# Altium project Masterboard_Lora_USB.PrjPcb
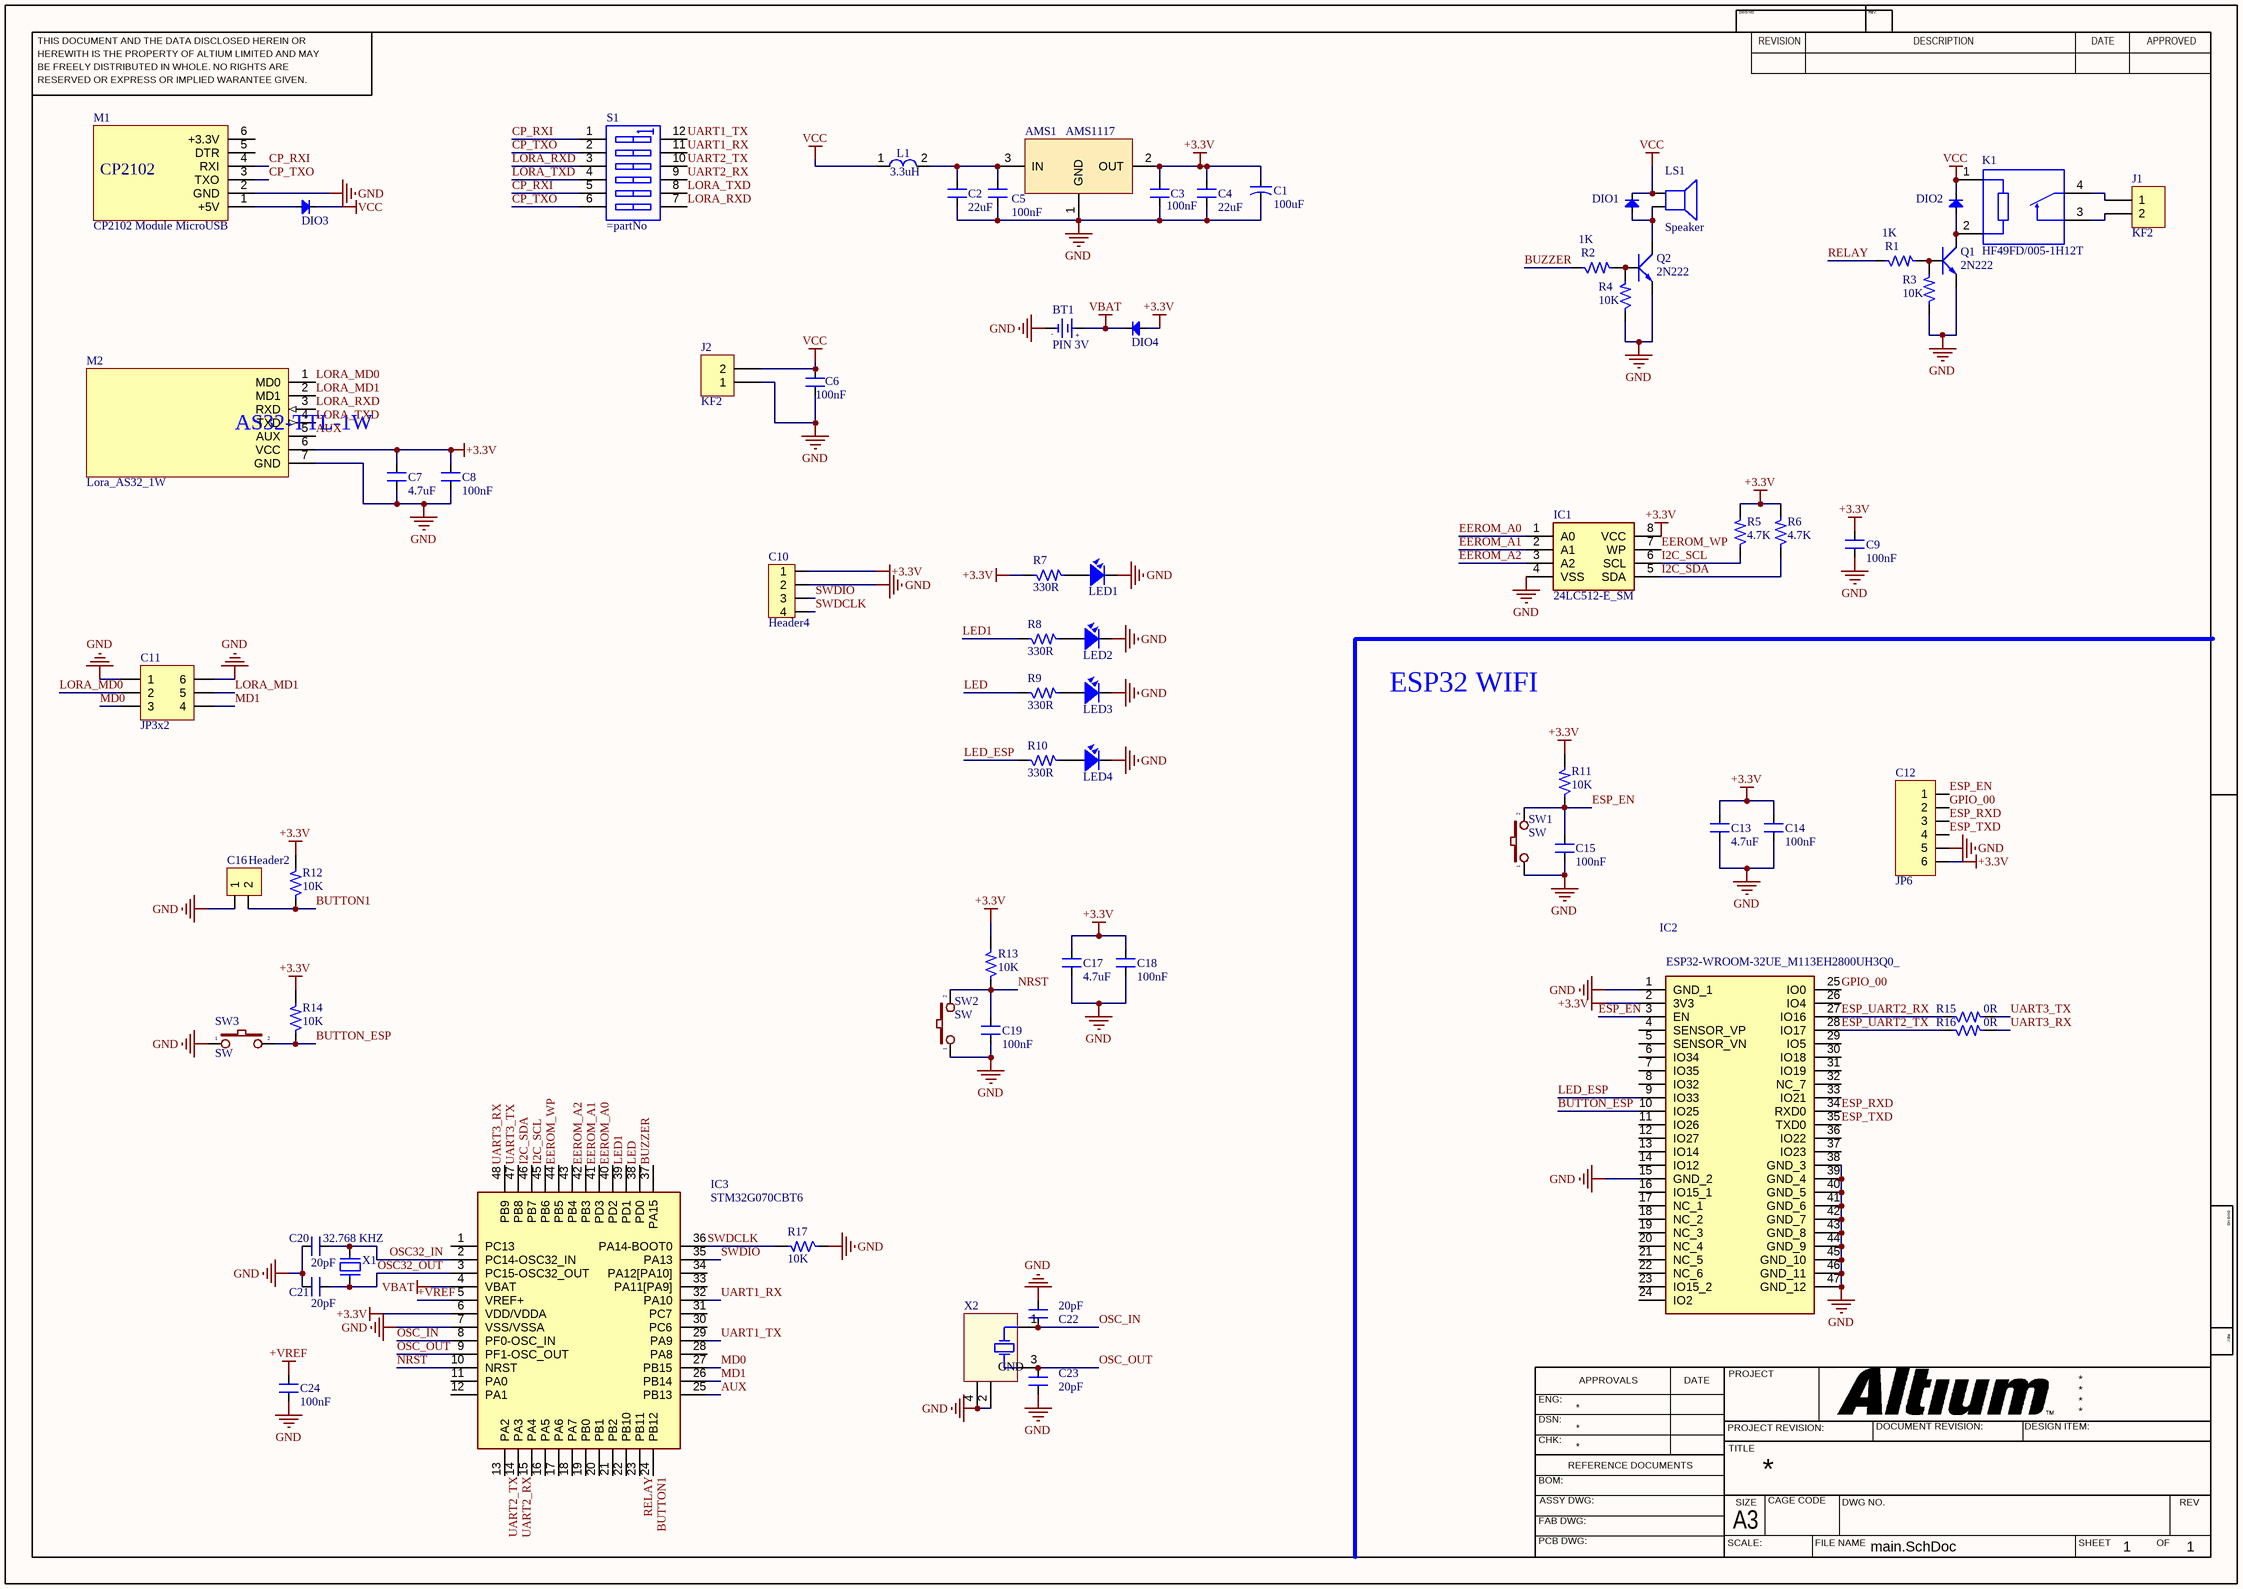
[diagram p0: main.SchDoc]
1 sheet, 69 parts. Net scope: global (net labels, ports and power ports of the same name join across sheets).
Board file: Masterboard_Lora_USB.PcbDoc

## Sheet main.SchDoc
size 420 x 297 mm; SheetNumber: 1; SheetTotal: 1

### Parts
AMS1  AMS1117  [SOT223_N]
BT1  PIN 3V  [PIN3V]
C1  100uF  [CA-ALU-5]
C2  22uF  [CAP_0805]
C3  100nF  [CAP_0603]
C4  22uF  [CAP_0805]
C5  100nF  [CAP_0603]
C6  100nF  [CN2.5]
C7  4.7uF  [CAP_0603]
C8  100nF  [CAP_0603]
C9  100nF  [CAP_0603]
C10  Header4  [Header4]
C11  JP3x2  [JP3-D2T]
C12  JP6  [JP6-C1T]
C13  4.7uF  [CAP_0603]
C14  100nF  [CAP_0603]
C15  100nF  [CAP_0603]
C16  Header2  [Header2]
C17  4.7uF  [CAP_0603]
C18  100nF  [CAP_0603]
C19  100nF  [CAP_0603]
C20  20pF  [CAP_0603]
C21  20pF  [CAP_0603]
C22  20pF  [CAP_0603]
C23  20pF  [CAP_0603]
C24  100nF  [CAP_0603]
DIO1  Diode SMD  [DIO-SMD-123]  (value not drawn)
DIO2  Diode SMD  [DIO-SMD-123]  (value not drawn)
DIO3  Diode SMD  [DIO-SMD-123]  (value not drawn)
DIO4  Diode SMD  [DIO-SMD-123]  (value not drawn)
IC1  24LC512-E_SM  [SOIC127P794X203-8N]
IC2  ESP32-WROOM-32UE_M113EH2800UH3Q0_  [ESP32WROOM32UEM113EH2800UH3Q0]
IC3  STM32G070CBT6  [QFP50P900X900X160-48N]
J1  KF2  [KF2-5.08]
J2  KF2  [KF2-5.08]
K1  HF49FD/005-1H12T  [RELAY_HF49FD/005-1H12T]
L1  3.3uH  [L-SMD-M-7.3x4.5]
LED1  LED  [LED-3MM-RED]  (value not drawn)
LED2  LED  [LED-3MM-GREEN]  (value not drawn)
LED3  LED  [LED-3MM-GREEN]  (value not drawn)
LED4  LED  [LED-3MM-GREEN]  (value not drawn)
LS1  Speaker  [SPEAKER]
M1  CP2102 Module MicroUSB  [CP2102 Module]
M2  Lora_AS32_1W  [LORA_AS32-TTL-1W]
Q1  2N222  [SOT23-231]
Q2  2N222  [SOT23-231]
R1  1K  [RES_0603]
R2  1K  [RES_0603]
R3  10K  [RES_0603]
R4  10K  [RES_0603]
R5  4.7K  [RES_0603]
R6  4.7K  [RES_0603]
R7  330R  [RES_0603]
R8  330R  [RES_0603]
R9  330R  [RES_0603]
R10  330R  [RES_0603]
R11  10K  [RES_0603]
R12  10K  [RES_0603]
R13  10K  [RES_0603]
R14  10K  [RES_0603]
R15  0R  [RES_0603]
R16  0R  [RES_0603]
R17  10K  [RES_0603]
S1  (no value)  [SW-DIP6]
SW1  SW  [SW1-SMD]
SW2  SW  [SW1-SMD]
SW3  SW  [SW1-SMD]
X1  32.768 KHZ  [XT2-32.768KHz-2_V]
X2  XT4  [XT4-16.000MHz-4_V]  (value not drawn)

### Nets
+3.3V: AMS1.2(OUT) C1.1 C3.2 C4.2 C7.2 C8.2 C9.2 C10.1 C12.6 C13.2 C14.2 C17.2 C18.2 DIO4.1(A) IC1.8(VCC) IC2.2(3V3) IC3.6(VDD/VDDA) M2.6(VCC) R5.2 R6.2 R7.1 R11.2 R12.2 R13.2 R14.2
+VREF: C24.2 IC3.5(VREF+)
GND: AMS1.1(GND) BT1.2(GND) C1.2 C2.1 C3.1 C4.1 C5.1 C6.1 C7.1 C8.1 C9.1 C10.2 C11.1 C11.6 C12.5 C13.1 C14.1 C15.1 C16.1 C17.1 C18.1 C19.1 C20.1 C21.1 C22.1 C23.1 C24.1 IC1.4(VSS) IC2.1(GND_1) IC2.15(GND_2) IC2.38(GND_3) IC2.39(GND_4) IC2.40(GND_5) IC2.41(GND_6) IC2.42(GND_7) IC2.43(GND_8) IC2.44(GND_9) IC2.45(GND_10) IC2.46(GND_11) IC2.47(GND_12) IC3.7(VSS/VSSA) J2.1 LED1.2 LED2.2 LED3.2 LED4.2 M1.2(GND) M2.7(GND) Q1.1(E) Q2.1(E) R3.1 R4.1 R17.1 SW1.1 SW2.1 SW3.1 X2.2(GND) X2.4(GND)
VBAT: BT1.1(+3V) DIO4.2(K) IC3.4(VBAT)
VCC: C6.2 DIO1.2(K) DIO2.2(K) DIO3.2(K) J2.2 K1.1(L1) L1.1 LS1.1
AUX: IC3.25(PB13) M2.5(AUX)
BUTTON1: C16.2 IC3.24(PB12) R12.1
BUTTON_ESP: IC2.10(IO25) R14.1 SW3.2
BUZZER: IC3.37(PA15) R2.1
CP_RXI: M1.4(RXI) S1.1 S1.5
CP_TXO: M1.3(TXO) S1.2 S1.6
EEROM_A0: IC1.1(A0) IC3.40(PD2)
EEROM_A1: IC1.2(A1) IC3.41(PD3)
EEROM_A2: IC1.3(A2) IC3.42(PB3)
EEROM_WP: IC1.7(WP) IC3.44(PB5)
ESP_EN: C12.1 C15.2 IC2.3(EN) R11.1 SW1.2
ESP_RXD: C12.3 IC2.34(RXD0)
ESP_TXD: C12.4 IC2.35(TXD0)
ESP_UART2_RX: IC2.27(IO16) R15.1
ESP_UART2_TX: IC2.28(IO17) R16.1
GPIO_00: C12.2 IC2.25(IO0)
I2C_SCL: IC1.6(SCL) IC3.45(PB6) R5.1
I2C_SDA: IC1.5(SDA) IC3.46(PB7) R6.1
LED: IC3.38(PD0) R9.1
LED1: IC3.39(PD1) R8.1
LED_ESP: IC2.9(IO33) R10.1
LORA_MD0: C11.2 M2.1(MD0)
LORA_MD1: C11.5 M2.2(MD1)
LORA_RXD: M2.3(RXD) S1.3 S1.7
LORA_TXD: M2.4(TXD) S1.4 S1.8
MD0: C11.3 IC3.27(PB15)
MD1: C11.4 IC3.26(PB14)
NRST: C19.2 IC3.10(NRST) R13.1 SW2.2
OSC32_IN: C20.2 IC3.2(PC14-OSC32_IN) X1.2
OSC32_OUT: C21.2 IC3.3(PC15-OSC32_OUT) X1.1
OSC_IN: C22.2 IC3.8(PF0-OSC_IN) X2.1(XTAL)
OSC_OUT: C23.2 IC3.9(PF1-OSC_OUT) X2.3(XTAL)
RELAY: IC3.23(PB11) R1.1
SWDCLK: C10.4 IC3.36(PA14-BOOT0) R17.2
SWDIO: C10.3 IC3.35(PA13)
UART1_RX: IC3.32(PA10) S1.11
UART1_TX: IC3.29(PA9) S1.12
UART2_RX: IC3.14(PA3) S1.9
UART2_TX: IC3.13(PA2) S1.10
UART3_RX: IC3.48(PB9) R16.2
UART3_TX: IC3.47(PB8) R15.2
NetAMS1_3: AMS1.3(IN) C2.2 C5.2 L1.2
NetDIO1_1: DIO1.1(A) LS1.2 Q2.3(C)
NetDIO2_1: DIO2.1(A) K1.2(L2) Q1.3(C)
NetDIO3_1: DIO3.1(A) M1.1(+5V)
NetJ1_1: J1.1 K1.4(C1)
NetJ1_2: J1.2 K1.3(C2)
NetLED1_1: LED1.1 R7.2
NetLED2_1: LED2.1 R8.2
NetLED3_1: LED3.1 R9.2
NetLED4_1: LED4.1 R10.2
NetQ1_2: Q1.2(B) R1.2 R3.2
NetQ2_2: Q2.2(B) R2.2 R4.2

Not connected (* = marked no-connect by the designer): IC2 4(SENSOR_VP) 5(SENSOR_VN) 6(IO34) 7(IO35) 8(IO32) 11(IO26) 12(IO27) 13(IO14) 14(IO12) 16(IO15_1) 17(NC_1) 18(NC_2) 19(NC_3) 20(NC_4) 21(NC_5) 22(NC_6) 23(IO15_2) 24(IO2) 26(IO4) 29(IO5) 30(IO18) 31(IO19) 32(NC_7) 33(IO21) 36(IO22) 37(IO23); IC3 1(PC13) 11(PA0) 12(PA1) 15(PA4) 16(PA5) 17(PA6) 18(PA7) 19(PB0) 20(PB1) 21(PB2) 22(PB10) 28(PA8) 30(PC6) 31(PC7) 33(PA11[PA9]) 34(PA12[PA10]) 43(PB4); M1 5(DTR) 6(+3.3V)

### Notes on the sheet
- ESP32 WIFI
- THIS DOCUMENT AND THE DATA DISCLOSED HEREIN OR
- HEREWITH IS THE PROPERTY OF ALTIUM LIMITED AND MAY
- DWG NO:
- REVISION
- REV:
- DESCRIPTION
- DATE
- APPROVED
- BE FREELY DISTRIBUTED IN WHOLE. NO RIGHTS ARE
- RESERVED OR EXPRESS OR IMPLIED WARANTEE GIVEN.
- ENG:
- APPROVALS
- PROJECT
- DSN:
- CHK:
- REFERENCE DOCUMENTS
- PROJECT REVISION:
- TITLE
- DOCUMENT REVISION:
- DESIGN ITEM:
- BOM:
- FAB DWG:
- PCB DWG:
- ASSY DWG:
- SCALE:
- A3
- SIZE
- CAGE CODE
- FILE NAME
- DWG NO.
- SHEET
- OF
- REV
- (in symbol CP2102 Module MicroUSB) CP2102
- (in symbol Lora_AS32_1W) AS32-TTL-1W
- (in symbol PIN 3V) -; +

### Library data of the parts
BT1 = PIN 3V: Battery 3VDC; Value: PIN 3V
C1 = CN-ALU-DIP: Capacitor (Semiconductor SIM Model); Value: 104; LatestRevisionDate: 17-Jul-2002; LatestRevisionNote: Re-released for DXP Platform.; PackageReference: C1206; Publisher: Altium Limited
C2 C4 = CAP_22uF-25V-20%-0805: 22µF ±20% 25V Ceramic Capacitor X5R 0805 (2012 Metric); Manufacturer: Murata Electronics; Manufacturer Part Number: GRM21BR61E226ME44K; Case/Package: 0805; Supplier-1: Digikey
C3 C5 C8 C9 C14 C15 C18 C19 C24 = CAP_100nF-10V-5%-0603: 0.1µF ±10% 10V Ceramic Capacitor X7R 0603 (1608 Metric); Manufacturer: Yageo; Manufacturer Part Number: CC0603KRX7R6BB104; Case/Package: 0603; Supplier-1: Digikey
C6 = CN: Value: 33pF
C7 C13 C17 = CAP_4.7uF-16V-10%-0603: 4.7µF ±10% 16V Ceramic Capacitor X5R 0603 (1608 Metric); Manufacturer: Murata Electronics; Manufacturer Part Number: GRM188R61C475KAAJD; Case/Package: 0603; Supplier-1: Digikey
C10 = Header4: Header IDC, 4 x 1 Pin Vertical 2.54mm Pitch (Non-Boxed, Male); Manufacturer: W¨¹rth Elektronik eiSos GmbH; partNo: 613002143121; ComponentLink1 Description: Manufacturer; ComponentLink2 Description: Datasheet; NoPins: 02; Created Date: 29 March 2013; ComponentLink1URL: http://www.we-online.com; ComponentLink2URL: http://katalog.we-online.de/em/datasheet/6130xx143121.pdf; Created by: Karrer Zheng
C11 = JP3x2: WR-PHD 2.54 mm Dual Socket Header; Manufacturer: W¨¹rth Elektronik eiSos GmbH; partNo: 61300621821; ComponentLink1 Description: Manufacturer; ComponentLink2 Description: Datasheet; NoPins: 06; Created Date: 29 March 2013; ComponentLink1URL: http://www.we-online.com; ComponentLink2URL: http://katalog.we-online.de/em/datasheet/6130xx21821.pdf; Created by: Karrer Zheng
C12 = JP6: WR-PHD 2.54 mm Angled Socket Header; Manufacturer: W¨¹rth Elektronik eiSos GmbH; partNo: 613006143121; ComponentLink1 Description: Manufacturer; ComponentLink2 Description: Datasheet; NoPins: 06; Created Date: 29 March 2013; ComponentLink1URL: http://www.we-online.com; ComponentLink2URL: http://katalog.we-online.de/em/datasheet/6130xx143121.pdf; Created by: Karrer Zheng
C16 = Header2: Header IDC, 2 x 1 Pin Vertical 2.54mm Pitch (Non-Boxed, Male); Manufacturer: W¨¹rth Elektronik eiSos GmbH; partNo: 613002143121; ComponentLink1 Description: Manufacturer; ComponentLink2 Description: Datasheet; NoPins: 02; Created Date: 29 March 2013; ComponentLink1URL: http://www.we-online.com; ComponentLink2URL: http://katalog.we-online.de/em/datasheet/6130xx143121.pdf; Created by: Karrer Zheng
C20-C23 = CAP_1nF-10V-10%-0603: 1000pF ±10% 10V Ceramic Capacitor X7R 0603 (1608 Metric); Manufacturer: Yageo; Manufacturer Part Number: CC0603KRX7R6BB102; Case/Package: 0603; Supplier-1: Digikey
DIO1-DIO4 = Diode SMD: Default Diode; Code - JEDEC: DO-214-AB; Value: 1N5007; Published: 8-Jun-2000; Revision: July-2002: Re-released for DXP Platform.; Publisher: Altium Limited
IC1 = 24LC512-E_SM: Integrated Circuit; Manufacturer_Name: Microchip; Manufacturer_Part_Number: 24LC512-E/SM; Datasheet Link: http://componentsearchengine.com/Datasheets/1/24LC512-E_SM.pdf; Height: 2.03mm; Mouser Part Number: 579-24LC512-E/SM; Mouser Price/Stock: https://www.mouser.co.uk/ProductDetail/Microchip-Technology/24LC512-E-SM?qs=gZwDaUDMhIcEA5S%2FxwtPXA%3D%3D; Arrow Part Number: 24LC512-E/SM; Arrow Price/Stock: https://www.arrow.com/en/products/24lc512-esm/microchip-technology
IC2 = ESP32-WROOM-32UE_M113EH2800UH3Q0_: Integrated Circuit; Manufacturer_Name: Espressif Systems; Manufacturer_Part_Number: ESP32-WROOM-32UE(M113EH2800UH3Q0); Datasheet Link: https://www.mouser.co.uk/datasheet/2/891/esp32_wroom_32e_esp32_wroom_32ue_datasheet_en-1855879.pdf; Height: 3.35mm; Mouser Part Number: 356-ESP32WRM32UE28UH; Mouser Price/Stock: https://www.mouser.co.uk/ProductDetail/Espressif-Systems/ESP32-WROOM-32UEM113EH2800UH3Q0?qs=vHuUswq2%252BswmjMZOJoYkgw%3D%3D
IC3 = STM32G070CBT6: Integrated Circuit; Manufacturer_Name: STMicroelectronics; Datasheet Link: http://www.mouser.com/datasheet/2/389/stm32g070cb-1517433.pdf; Height: 1.6mm; Manufacturer_Part_Number: STM32G070CBT6; Mouser Part Number: 511-STM32G070CBT6; Mouser Price/Stock: https://www.mouser.co.uk/ProductDetail/STMicroelectronics/STM32G070CBT6?qs=l7cgNqFNU1gFKn1as7Ms0g%3D%3D; Arrow Part Number: STM32G070CBT6; Arrow Price/Stock: https://www.arrow.com/en/products/stm32g070cbt6/stmicroelectronics?region=nac
J1 J2 = KF2: Manufacturer: Würth Elektronik eiSos GmbH; partNo: 691103110002; ComponentLink1 Description: Manufacturer; ComponentLink2 Description: Datasheet; NoPins: 2; Created Date: 29 October 2013; ComponentLink1URL: http://www.we-online.com; ComponentLink2URL: http://katalog.we-online.de/em/datasheet/6911031100xx.pdf; Created by: Karrer Zheng
K1 = HF49FD/005-1H12T: Relay: electromagnetic; SPST-NO; Ucoil: 5VDC; 5A/250VAC; 5A/30VDC; MF: Hongfa; Price: None; SnapEDA_Link: https://www.snapeda.com/parts/HF49FD/005-1H12T/Hongfa/view-part/2753221/?ref=snap; MP: HF49FD/005-1H12T; Value: *; Availability: Unavailable; Package: None
L1 = L-SMD-1: partNo: 78477010; Manufacturer: Wurth Elektronik; Inductance: 1.0 μH; ComponentLink1Description: Manufacturer; ComponentLink1URL: http://www.we-online.de; Created by: Baojun Chen; Created Date: Nov.2015; ComponentLink2Description: Datasheet; ComponentLink2URL: http://katalog.we-online.de/pbs/datasheet/78477010.pdf
LED1-LED4 = LED: LED Single colour Green and Red; Value: LED 3 ly Single Colour
LS1 = Speaker: Loudspeaker; Published: 24-Mar-1999; LatestRevisionDate: 17-Jul-2002; LatestRevisionNote: Re-released for DXP Platform.; PackageReference: PIN2; Publisher: Altium Limited
Q1 Q2 = 2N222: NPN 600mW, ECB; Value: C1815
R1 R2 R13 R17 = RES_1K-0.1W-1%-0603: 1 kOhms ±1% 0.1W, 1/10W Chip Resistor 0603 (1608 Metric) Thick Film; Manufacturer: Yageo; Manufacturer Part Number: RC0603FR-071KL; Case/Package: 0603; Supplier-1: Digikey
R3 R4 R11 R12 R14 = RES_10K-0.1W-1%-0603: 10 kOhms ±1% 0.1W, 1/10W Chip Resistor 0603 (1608 Metric) Thick Film; Manufacturer: Yageo; Manufacturer Part Number: RC0603FR-0710KL; Case/Package: 0603; Supplier-1: Digikey
R5-R10 = RES_3.3R-0.1W-1%-0603: 3.3 Ohms ±1% 0.1W, 1/10W Chip Resistor 0603 (1608 Metric) Automotive AEC-Q200, Current Sense Thick Film; Manufacturer: Panasonic Electronic Components; Manufacturer Part Number: ERJ-3RQF3R3V; Case/Package: 0603; Supplier-1: Digikey
R15 R16 = RES_0R-0.1W-1%-0603: 0 Ohms Jumper 0.1W, 1/10W Chip Resistor 0603 (1608 Metric) Thick Film; Manufacturer: Yageo; Manufacturer Part Number: RC0603JR-070RL; Case/Package: 0603; Supplier-1: Digikey
S1 = SWDIP6: WS-DITV 2.54 mm small compact THT flat actuator with top tape; Manufacturer: Wurth Elektronik; Part No.: 418127160906; ComponentLink1 Description: Manufacturer; ComponentLink2 Description: Datasheet; Pole: 06; Created Date: Dec.2015; ComponentLink1URL: http://www.we-online.com; ComponentLink2URL: http://katalog.we-online.de/em/datasheet/4181271609xx.pdf; Created by: Baojun Chen
SW1-SW3 = SW2: Switch button 2 pin; Value: SW chip 2 pin
X1 = XT2: Crystal, 32.768 KHz, -40 to 85 degC, 3.2 x 1.5 x 0.9 mm SMD; Value: 4Mhz
X2 = XT4: Crystal, 16 MHz, -30 to 85 degC, 3.2 x 2.5 x 0.9 mm SMD; Value: 4Mhz